# Altium schematic sheet 2_Part_Conveter.schdoc
size 426 x 304 mm; Symbol: Sheet-Symbol_A3; Device: Sheet-Symbol_A3; Convert to PCB: yes; Add into BOM: yes; Company: 深圳嘉立创科技发展有限公司; Drawed: 嘉立创EDA; Reviewed: 嘉立创EDA; Version: V0.1; Page Size: A3; @Project Name: Catch5Yeah; @Page Count: 2; @Update Date: 2022-01-24; @Create Date: 2022-01-24; @Schematic Name: Sch_MainBroad; Part Number: JLCPCB-001; @Page No: 2; @Page Name: P1
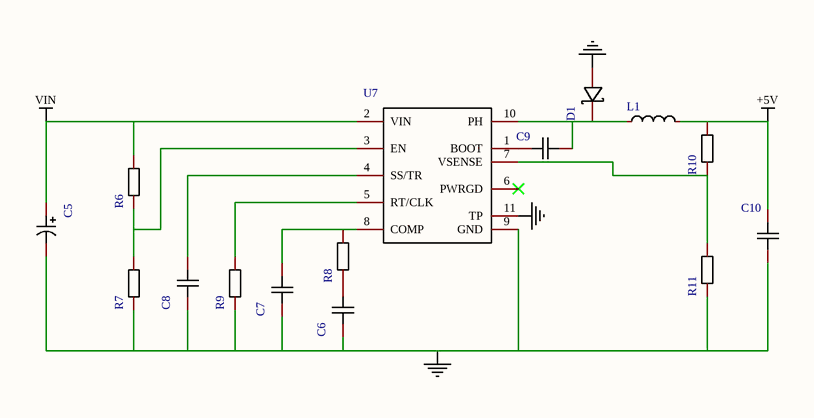
[diagram p0: 2_Part_Conveter.schdoc]

## Parts
C5  RVT10UF100V67RV0110_1  [CAP-SMD_BD6.3-L6.6-W6.6-LS7.4-FD]  (value not drawn)
C6  C0603C102K1RAC3083  [C0603]  (value not drawn)
C7  C0603C102K1RAC3083  [C0603]  (value not drawn)
C8  C0603C102K1RAC3083  [C0603]  (value not drawn)
C9  C0603C102K1RAC3083  [C0603]  (value not drawn)
C10  GRM32ER60J476ME20L_1  [C1210]  (value not drawn)
D1  SS24_1  [SMA_L4.4-W2.6-LS5.0-RD]  (value not drawn)
L1  CYH74-33UH_1  [IND-SMD_L7.5-W7.5_CYH74]  (value not drawn)
R6  CR0603FA5603G_1  [R0603]  (value not drawn)
R7  CR0603FA5603G_1  [R0603]  (value not drawn)
R8  CR0603FA5603G_1  [R0603]  (value not drawn)
R9  CR0603FA5603G_1  [R0603]  (value not drawn)
R10  CR0603FA5603G_1  [R0603]  (value not drawn)
R11  CR0603FA5603G_1  [R0603]  (value not drawn)
U7  TPS54160DGQR_1  [MSOP-10_L3.0-W3.0-P0.50-LS5.0-BL-EP]  (value not drawn)

## Nets
+5V: C10.2 L1.2 R10.2
GND: C5.2 C6.1 C7.1 C8.1 C10.1 D1.2(A) R7.1 R9.1 R11.1 U7.9(GND) U7.11(TP)
VIN: C5.1 R6.2 U7.2(VIN)
NetC6_2: C6.2 R8.1
NetC7_2: C7.2 R8.2 U7.8(COMP)
NetC8_2: C8.2 U7.4(SS/TR)
NetC9_1: C9.1 D1.1(C) L1.1 U7.10(PH)
NetC9_2: C9.2 U7.1(BOOT)
NetR6_1: R6.1 R7.2 U7.3(EN)
NetR9_2: R9.2 U7.5(RT/CLK)
NetR10_1: R10.1 R11.2 U7.7(VSENSE)

Not connected (* = marked no-connect by the designer): U7 6(PWRGD)*

## Notes on the sheet
- 1
- 2
- 3
- 4
- 5
- 6
- A
- B
- C
- Schematic
- Sch_MainBroad
- Create Date
- Update Date
- 2022-01-24
- D
- Reviewed
- Drawed
- 嘉立创EDA
- P1
- Part Number
- Catch5Yeah
- JLCPCB-001
- VER
- SIZE
- PAGE
- OF
- V0.1
- A3
- 深圳嘉立创科技发展有限公司

## Library data of the parts
C5 = RVT10UF100V67RV0110_1: 工作寿命:2000hrs@105℃;; Manufacturer: KNSCHA(科尼盛); Add into BOM: yes; Symbol: RVT10UF100V67RV0110; Device: RVT10UF100V67RV0110_1; LCSC Part Name: 10uF 100V; Supplier Part: C2895274; Manufacturer Part: RVT10UF100V67RV0110; LCSC On Sale: 1; Supplier Footprint: SMD,6.3x7.7mm; JLCPCB Part Class: Extended Part; JLCPCB On Sale: 1; Datasheet: https://atta.szlcsc.com/upload/public/pdf/source/20210913/542235CCA574B14A24D00D138509D796.pdf; Supplier: LCSC; Convert to PCB: yes; Lifetime @ Temp: 2000hrs@105℃
C6 C7 = C0603C102K1RAC3083: 容值:1nF;精度:±10%;额定电压:100V;温度系数:X7R;; Manufacturer: KEMET(基美); Add into BOM: yes; Value: 6.8pF; Tolerance: ±10%; Voltage Rated: 100V; Temperature Coefficient: X7R; Symbol: C0603C102K1RAC3083; Device: C0603C102K1RAC3083; LCSC Part Name: 1nF ±10% 100V; Supplier Part: C561818; Manufacturer Part: C0603C102K1RAC3083; LCSC On Sale: 1; Supplier Footprint: 0603; JLCPCB Part Class: Extended Part; JLCPCB On Sale: 1; Datasheet: https://atta.szlcsc.com/upload/public/pdf/source/20200618/C599608_2B9CFB7169FD5127D28BF69D59417288.pdf; Supplier: LCSC; Convert to PCB: yes
C8 = C0603C102K1RAC3083: 容值:1nF;精度:±10%;额定电压:100V;温度系数:X7R;; Manufacturer: KEMET(基美); Add into BOM: yes; Value: 6.8nF; Tolerance: ±10%; Voltage Rated: 100V; Temperature Coefficient: X7R; Symbol: C0603C102K1RAC3083; Device: C0603C102K1RAC3083; LCSC Part Name: 1nF ±10% 100V; Supplier Part: C561818; Manufacturer Part: C0603C102K1RAC3083; LCSC On Sale: 1; Supplier Footprint: 0603; JLCPCB Part Class: Extended Part; JLCPCB On Sale: 1; Datasheet: https://atta.szlcsc.com/upload/public/pdf/source/20200618/C599608_2B9CFB7169FD5127D28BF69D59417288.pdf; Supplier: LCSC; Convert to PCB: yes
C9 = C0603C102K1RAC3083: 容值:1nF;精度:±10%;额定电压:100V;温度系数:X7R;; Manufacturer: KEMET(基美); Add into BOM: yes; Value: 100nF; Tolerance: ±10%; Voltage Rated: 100V; Temperature Coefficient: X7R; Symbol: C0603C102K1RAC3083; Device: C0603C102K1RAC3083; LCSC Part Name: 1nF ±10% 100V; Supplier Part: C561818; Manufacturer Part: C0603C102K1RAC3083; LCSC On Sale: 1; Supplier Footprint: 0603; JLCPCB Part Class: Extended Part; JLCPCB On Sale: 1; Datasheet: https://atta.szlcsc.com/upload/public/pdf/source/20200618/C599608_2B9CFB7169FD5127D28BF69D59417288.pdf; Supplier: LCSC; Convert to PCB: yes
C10 = GRM32ER60J476ME20L_1: 容值:47uF;精度:±20%;额定电压:6.3V;温度系数:X5R;; Manufacturer: muRata(村田); Add into BOM: yes; Value: 47uF; Tolerance: ±20%; Voltage Rated: 6.3V; Temperature Coefficient: X5R; Symbol: GRM32ER60J476ME20L_1; Device: GRM32ER60J476ME20L_1; LCSC Part Name: 47uF ±20% 6.3V; Supplier Part: C167458; Manufacturer Part: GRM32ER60J476ME20L; LCSC On Sale: 1; Supplier Footprint: 1210; JLCPCB Part Class: Extended Part; JLCPCB On Sale: 1; Datasheet: https://atta.szlcsc.com/upload/public/pdf/source/20181017/C167458_1064E5437E66E5318C6A2C7AF8F96813.pdf; Supplier: LCSC; Convert to PCB: yes
D1 = SS24_1: 直流反向耐压(Vr):40V;平均整流电流(Io):2A;正向压降(Vf):550mV@1A;; Manufacturer: SINO-IC(光宇睿芯); Manufacturer Part: SS24; Symbol: SS24_C355269; Add into BOM: yes; Reverse Voltage (Vr): 40V; Average Rectified Current (Io): 2A; Device: SS24_1; LCSC Part Name: 40V 2A 550mV@1A; Supplier Part: C355269; LCSC On Sale: 1; Supplier Footprint: SMA; JLCPCB Part Class: Extended Part; JLCPCB On Sale: 1; Datasheet: https://atta.szlcsc.com/upload/public/pdf/source/20190807/C355269_02DF8F022D3812B571D1E66B40926818.pdf; Supplier: LCSC; Convert to PCB: yes; Forward Voltage (Vf@If): 550mV@1A
L1 = CYH74-33UH_1: Manufacturer: SHOU HAN(首韩); Add into BOM: yes; Symbol: CYH74-33UH; Device: CYH74-33UH_1; LCSC Part Name: 33uH ±20%; Supplier Part: C2879696; Manufacturer Part: CYH74-33UH; LCSC On Sale: 1; Supplier Footprint: SMD,7.5x7.5x4.5mm; JLCPCB Part Class: Extended Part; JLCPCB On Sale: 1; Datasheet: https://atta.szlcsc.com/upload/public/pdf/source/20210813/91E1001E07795DE2AA14A81FBCD1BD6C.pdf; Supplier: LCSC; Convert to PCB: yes
R6 R8 = CR0603FA5603G_1: 电阻类型:厚膜电阻;阻值:560kΩ;精度:±1%;功率:1/10W;温度系数:±100ppm/℃;最大工作电压:50V;工作温度范围:-55℃~+125℃;; Manufacturer: LIZ(丽智电子); Add into BOM: yes; Value: 105kΩ; Tolerance: ±1%; Power(Watts): 1/10W; Overload Voltage (Max): 50V; Symbol: CR0603FA5603G; Device: CR0603FA5603G_1; LCSC Part Name: 560kΩ ±1%; Supplier Part: C101109; Manufacturer Part: CR0603FA5603G; LCSC On Sale: 1; Supplier Footprint: 0603; JLCPCB Part Class: Extended Part; JLCPCB On Sale: 1; Datasheet: https://atta.szlcsc.com/upload/public/pdf/source/20170408/1491631395612.pdf; Supplier: LCSC; Convert to PCB: yes; Type: 厚膜电阻; Temperature Coefficient: ±100ppm/℃; Operating Temperature Range: -55℃~+125℃
R7 = CR0603FA5603G_1: 电阻类型:厚膜电阻;阻值:560kΩ;精度:±1%;功率:1/10W;温度系数:±100ppm/℃;最大工作电压:50V;工作温度范围:-55℃~+125℃;; Manufacturer: LIZ(丽智电子); Add into BOM: yes; Value: 19.1kΩ; Tolerance: ±1%; Power(Watts): 1/10W; Overload Voltage (Max): 50V; Symbol: CR0603FA5603G; Device: CR0603FA5603G_1; LCSC Part Name: 560kΩ ±1%; Supplier Part: C101109; Manufacturer Part: CR0603FA5603G; LCSC On Sale: 1; Supplier Footprint: 0603; JLCPCB Part Class: Extended Part; JLCPCB On Sale: 1; Datasheet: https://atta.szlcsc.com/upload/public/pdf/source/20170408/1491631395612.pdf; Supplier: LCSC; Convert to PCB: yes; Type: 厚膜电阻; Temperature Coefficient: ±100ppm/℃; Operating Temperature Range: -55℃~+125℃
R9 = CR0603FA5603G_1: 电阻类型:厚膜电阻;阻值:560kΩ;精度:±1%;功率:1/10W;温度系数:±100ppm/℃;最大工作电压:50V;工作温度范围:-55℃~+125℃;; Manufacturer: LIZ(丽智电子); Add into BOM: yes; Value: 267kΩ; Tolerance: ±1%; Power(Watts): 1/10W; Overload Voltage (Max): 50V; Symbol: CR0603FA5603G; Device: CR0603FA5603G_1; LCSC Part Name: 560kΩ ±1%; Supplier Part: C101109; Manufacturer Part: CR0603FA5603G; LCSC On Sale: 1; Supplier Footprint: 0603; JLCPCB Part Class: Extended Part; JLCPCB On Sale: 1; Datasheet: https://atta.szlcsc.com/upload/public/pdf/source/20170408/1491631395612.pdf; Supplier: LCSC; Convert to PCB: yes; Type: 厚膜电阻; Temperature Coefficient: ±100ppm/℃; Operating Temperature Range: -55℃~+125℃
R10 = CR0603FA5603G_1: 电阻类型:厚膜电阻;阻值:560kΩ;精度:±1%;功率:1/10W;温度系数:±100ppm/℃;最大工作电压:50V;工作温度范围:-55℃~+125℃;; Manufacturer: LIZ(丽智电子); Add into BOM: yes; Value: 52.3kΩ; Tolerance: ±1%; Power(Watts): 1/10W; Overload Voltage (Max): 50V; Symbol: CR0603FA5603G; Device: CR0603FA5603G_1; LCSC Part Name: 560kΩ ±1%; Supplier Part: C101109; Manufacturer Part: CR0603FA5603G; LCSC On Sale: 1; Supplier Footprint: 0603; JLCPCB Part Class: Extended Part; JLCPCB On Sale: 1; Datasheet: https://atta.szlcsc.com/upload/public/pdf/source/20170408/1491631395612.pdf; Supplier: LCSC; Convert to PCB: yes; Type: 厚膜电阻; Temperature Coefficient: ±100ppm/℃; Operating Temperature Range: -55℃~+125℃
R11 = CR0603FA5603G_1: 电阻类型:厚膜电阻;阻值:560kΩ;精度:±1%;功率:1/10W;温度系数:±100ppm/℃;最大工作电压:50V;工作温度范围:-55℃~+125℃;; Manufacturer: LIZ(丽智电子); Add into BOM: yes; Value: 10kΩ; Tolerance: ±1%; Power(Watts): 1/10W; Overload Voltage (Max): 50V; Symbol: CR0603FA5603G; Device: CR0603FA5603G_1; LCSC Part Name: 560kΩ ±1%; Supplier Part: C101109; Manufacturer Part: CR0603FA5603G; LCSC On Sale: 1; Supplier Footprint: 0603; JLCPCB Part Class: Extended Part; JLCPCB On Sale: 1; Datasheet: https://atta.szlcsc.com/upload/public/pdf/source/20170408/1491631395612.pdf; Supplier: LCSC; Convert to PCB: yes; Type: 厚膜电阻; Temperature Coefficient: ±100ppm/℃; Operating Temperature Range: -55℃~+125℃
U7 = TPS54160DGQR_1: 功能类型:降压型;同步整流:-;输出通道数:-;拓扑结构:-;输入电压:-;输出电流(最大值):-;开关频率:-;; Manufacturer: TI(德州仪器); Add into BOM: yes; Function: 降压型; Symbol: TPS54160DGQR; Device: TPS54160DGQR_1; LCSC Part Name: 降压型; Supplier Part: C13530; Manufacturer Part: TPS54160DGQR; LCSC On Sale: 1; Supplier Footprint: MSOP-10EP; JLCPCB Part Class: Extended Part; JLCPCB On Sale: 1; Datasheet: https://atta.szlcsc.com/upload/public/pdf/source/20130605/1457706608274.pdf; Supplier: LCSC; Convert to PCB: yes; Synchronous Rectification: -; Number of Outputs: -; Topology: -; Input Voltage: -; Output Current (Max): -; Switching Frequency: -